# Altium schematic sheet Test_Jig_Project.SchDoc
size A3
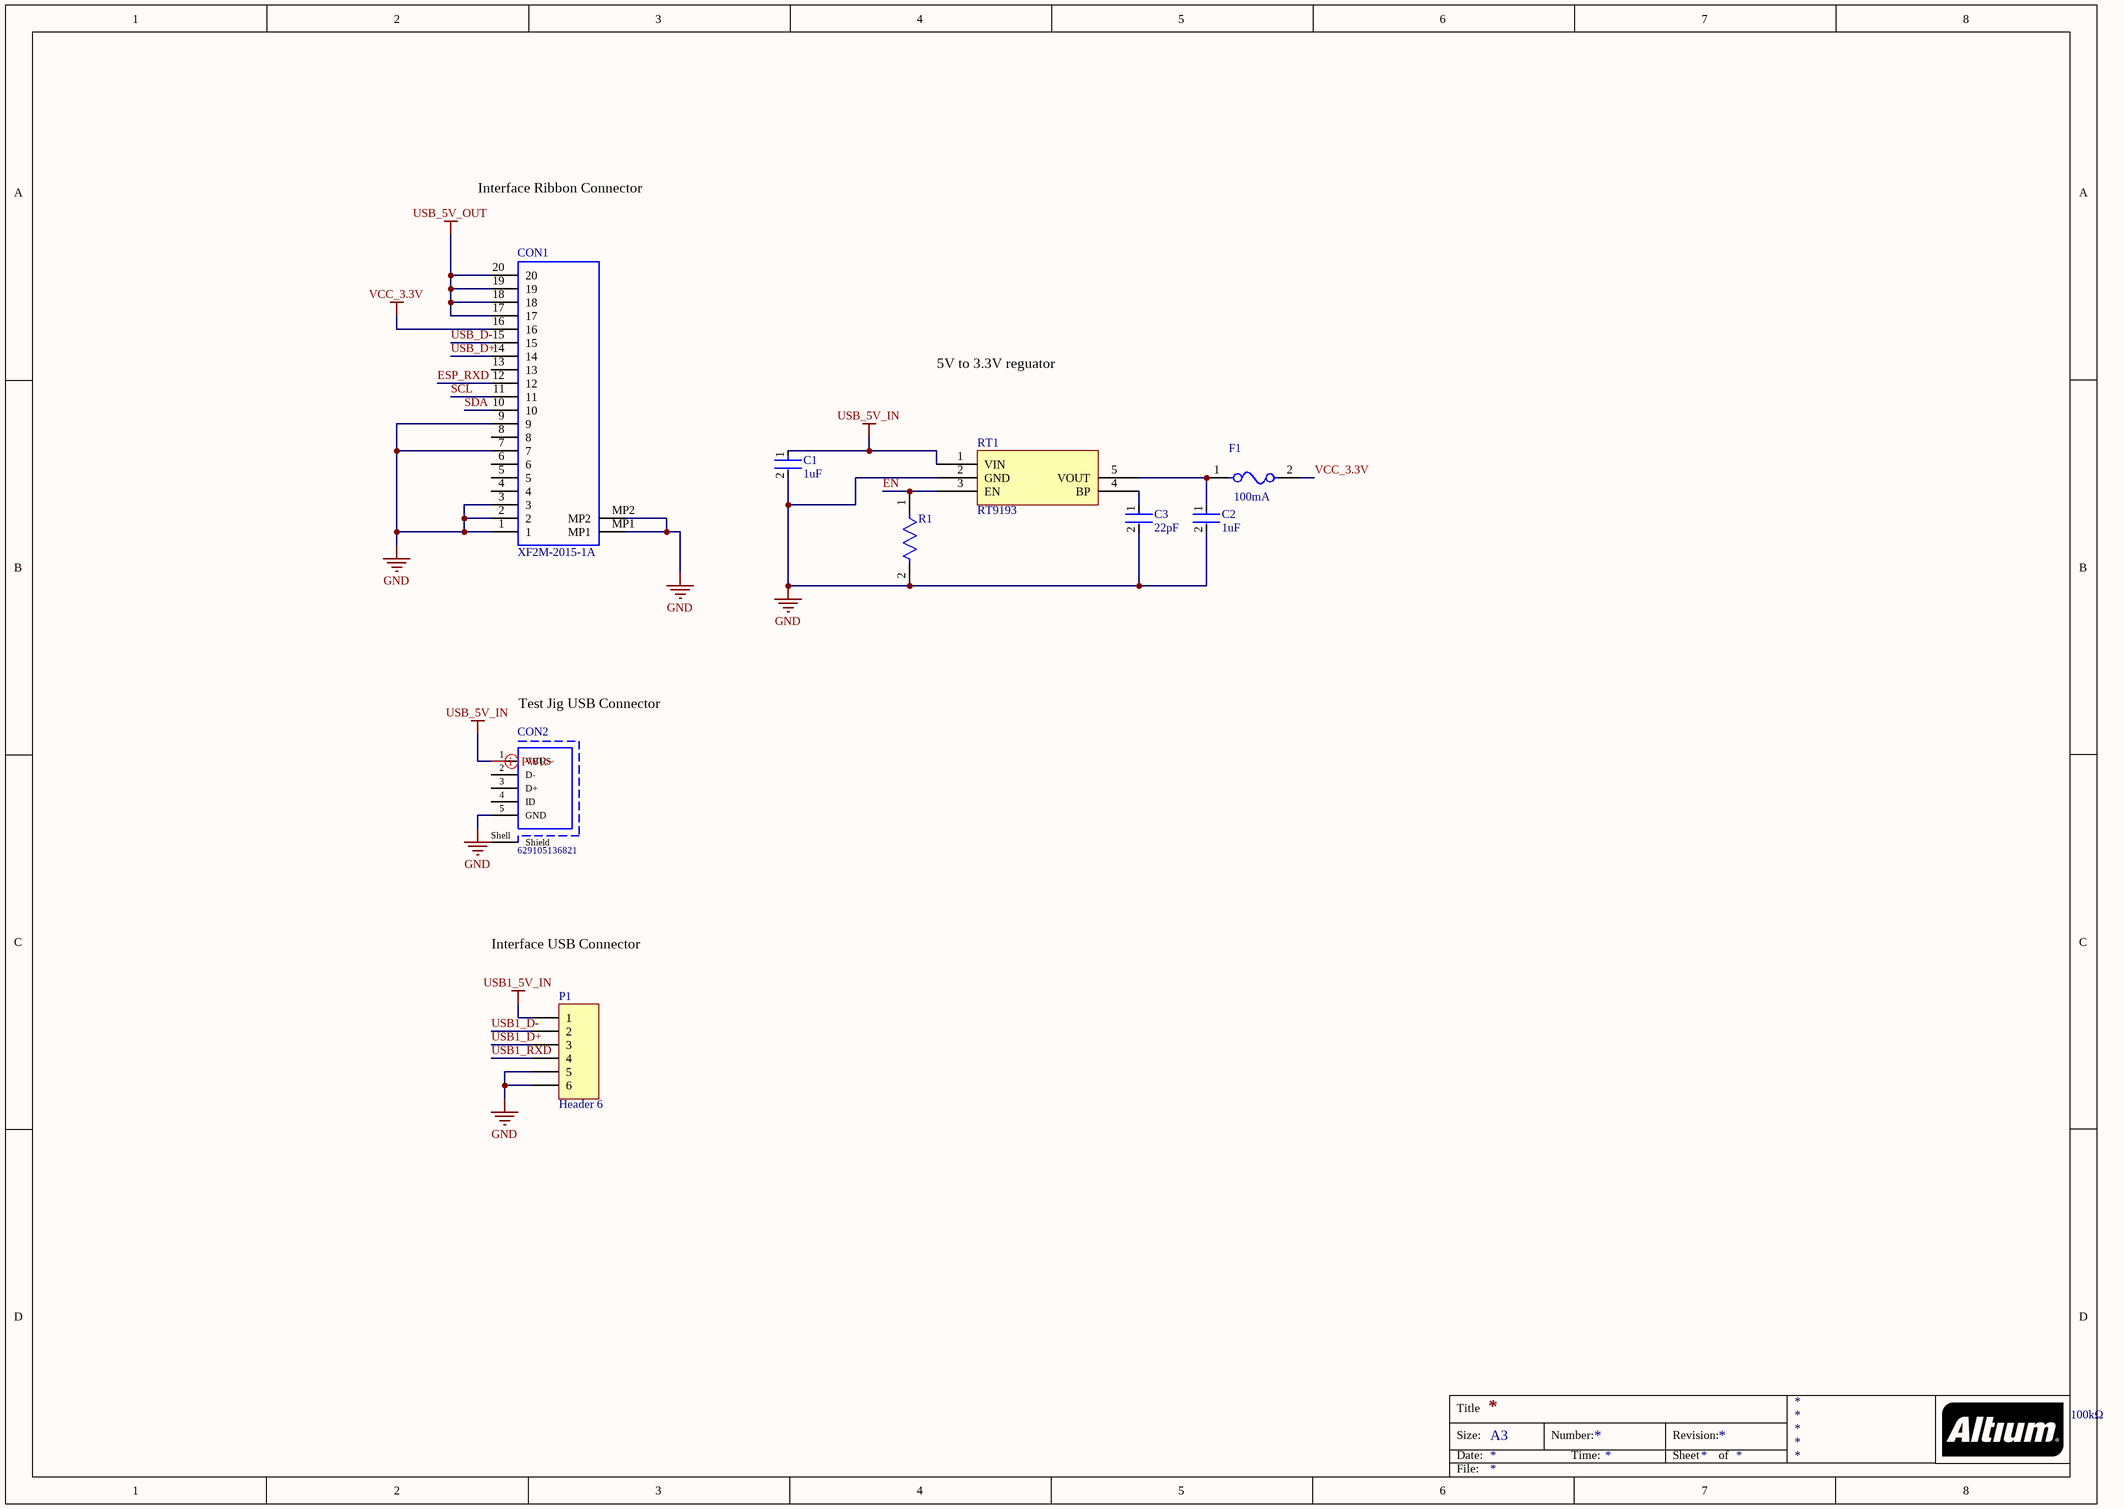
[diagram p0: Test_Jig_Project.SchDoc]

## Parts
C1  1uF  [FP-CC0805-0_85-MFG]
C2  1uF  [FP-CC0805-0_85-MFG]
C3  22pF  [FP-C0402-BB-MFG]
CON1  XF2M-2015-1A  [XF2M20151A]
CON2  629105136821  [629105136821]
F1  100mA  [FP-MF-PSMF-MFG]
P1  Header 6  [HDR1X6]
R1  100kΩ  [FP-CRCW0402-e3-IPC_C]
RT1  RT9193  [SOT85P279X130-5N]

## Nets
GND: C1.2 C2.2 C3.2 CON1.1 CON1.2 CON1.3 CON1.7 CON1.9 CON1.MP1 CON1.MP2 CON2.5(GND) P1.5 P1.6 R1.2 RT1.2(GND)
USB1_5V_IN: P1.1
USB_5V_IN: C1.1 CON2.1(VBUS) RT1.1(VIN)
USB_5V_OUT: CON1.17 CON1.18 CON1.19 CON1.20
VCC_3.3V: CON1.16 F1.2
EN: R1.1 RT1.3(EN)
ESP_RXD: CON1.12
SCL: CON1.11
SDA: CON1.10
USB1_D+: P1.3
USB1_D-: P1.2
USB1_RXD: P1.4
USB_D+: CON1.14
USB_D-: CON1.15
NetC2_1: C2.1 F1.1 RT1.5(VOUT)
NetC3_1: C3.1 RT1.4(BP)

Not connected (* = marked no-connect by the designer): CON1 4 5 6 8 13; CON2 2(D-) 3(D+) 4(ID) Shell(Shield)

## Layout directives
rule Width Constraint [Pref Width = 12mil    Min Width = 6mil    Max Width = 12mil]: USB_5V_IN

## Notes on the sheet
- Interface Ribbon Connector
- 5V to 3.3V reguator
- (near CON2) Test Jig USB Connector
- Interface USB Connector
- Manufacturer
- Title
- Size:
- Date:
- A3
- Number:
- Time:
- Revision:
- Sheet
- of
- File:

## Library data of the parts
C1 C2 = CMP-03422-000182-1: CAP CER 1UF 10V X7R 0805; Manufacturer: Yageo; Mfr. Part #: CC0805KKX7R6BB105; Material: Ceramic; Tolerance: 0.1; Value: 1 uF; ComponentLink2URL: http://www.yageo.com/documents/recent/UPY-GPHC_Y5V_6.3V-to-50V_8.pdf; Automotive: No; Temperature Range Low: -30°C; Octopart: https://octopart.com/cc0805kkx7r6bb105-yageo-42522859; Temperature Characteristic: X7R; RoHS: TRUE; Voltage Rating: 10 V; Capacitance: 1 uF; Package: CC0805-0.85; Device Class L3: Ceramic Capacitors; Category: Cap; Mouser Description: Multilayer Ceramic Capacitors MLCC - SMD/SMT 1.0uF 10V X7R 10%; Temperature Range High: +85°C; Ipc Land Pattern Name: CAPC200125X85; ComponentLink2Description: Datasheet; Temperature: -30°C to +85°C; Height: 0.95mm; Lead Free: Yes; Device Class L1: Passive Components; Device Class L2: Capacitors; Footprint Url: http://www.yageo.com/exep/pages/download/literatures/UPY-C_GEN_24.pdf; Digikey Description: CAP CER 1UF 10V X7R 0805
C3 = CMP-1034-00897-3: CAP CER 22PF 10V NP0 0402; Mfr. Part #: C0402C220K8GACTU; Manufacturer: Kemet; Temperature Coefficient: 15%; Tolerance: 0.1; Temperature Characteristic: C0G; Material: Ceramic; Ipc Land Pattern Name: CAPC10050X50; Mouser Description: Multilayer Ceramic Capacitors MLCC - SMD/SMT 10volts 22pF C0G 10%; Temperature Range High: +125°C; Voltage Rating: 10 V; ComponentLink2Description: Datasheet; Digikey Description: CAP CER 22PF 10V NP0 0402; Device Class L1: Passive Components; Category: Cap; Temperature: -55°C to +125°C; Temperature Range Low: -55°C; ComponentLink2URL: https://content.kemet.com/datasheets/KEM_C1002_X7R_SMD.pdf; Automotive: No; Package: C0402-BB; RoHS: TRUE; Device Class L3: Ceramic Capacitors; Value: 22 pF; Height: 0.55mm; Octopart: https://octopart.com/c0402c220k8gactu-kemet-12592189; Capacitance: 22 pF; Lead Free: Yes; Device Class L2: Capacitors
CON1 = XF2M-2015-1A: OMRON - XF2M-2015-1A - FFC / FPC Board Connector, 0.5 mm, 20 Contacts, Receptacle, XF Series, Surface Mount, Top, Bottom; Manufacturer: Omron Electronics; Geometry.Height: 3.2mm; Mfr. Part #: XF2M-2015-1A; Mouser Part Number: 653-XF2M-2015-1A; Mouser Price/Stock: https://www.mouser.co.uk/ProductDetail/Omron-Electronics/XF2M-2015-1A?qs=9iNEzSI19qWZ677VhkompQ%3D%3D; Arrow Part Number: *; Unit Price: US$ 0.4815; Datasheet Link: https://datasheet.lcsc.com/lcsc/1912111437_Omron-Electronics-XF2M-2015-1A_C57541.pdf
CON2 = CMP-1502-03253-1: Micro USB 2.0 Type B Receptacle WR-COM, Horizontal, SMT, with Pads and Pegs; Manufacturer: Wurth Elektronik; Mfr. Part #: 629105150521; Contact Resistance: 30mOhm; Rated Current: 1A; Working Voltage: 30VAC; Datasheet URL: https://katalog.we-online.de/em/datasheet/629105136821.pdf; Mounting Technology: SMT; Publisher: WurthElektronik; Package Reference: 629105136821; Orientation: Horizontal; Packaging: TapeandReel; Manufacturer URL: http://www.we-online.de; Connector Type: MicroUSB2.0TypeB; Gender: Receptacle; Operating Temperature: -40to105degC
F1 = CMP-07400-000017-1: PTC RESET FUSE 15V 100MA 0805; Mfr. Part #: MF-PSMF010X-2; Manufacturer: Bourns Inc.; Resistance: 1-7.5Ω; Value: 1-7.5Ω; Current Rating: 40A; Hold Current: 0.1A; Trip Current: 0.3A; Trip Time: 1.5s; Temperature: -40°C to +85°C; ComponentLink2Description: Datasheet; Lead Free: Yes; Ipc Land Pattern Name: CAPC215135X67; Device Class L1: Circuit Protection; Mouser Description: Resettable Fuses - PPTC 0.10A 15V 1ohm; Automotive: No; Octopart: https://octopart.com/mf-psmf010x-2-bourns-7483441; RoHS: TRUE; Temperature Range High: +85°C; Digikey Description: PTC RESET FUSE 15V 100MA 0805; Device Class L3: unset; ComponentLink2URL: https://www.bourns.com/docs/Product-Datasheets/mfpsmf.pdf; Height: 0.85mm; Voltage Rating: 15V; Ambient Temperature Range Low: -40°C; Category: Fuse; Package: MF-PSMF; Temperature Range Low: -40°C; Device Class L2: PTC Resettable Fuses; Ambient Temperature Range High: +85°C
P1 = Header 6: Header, 6-Pin; LatestRevisionDate: 17-Jul-2002; LatestRevisionNote: Re-released for DXP Platform.; Publisher: Altium Limited
R1 = CMP-2002-08123-3: RES Thick Film, 100kΩ, 1%, 0.063W, 100ppm/°C, 0402; Manufacturer: Stackpole Electronics; Mfr. Part #: RMCF0402FT100K; Power Rating: 63mW; Resistance: 100kR; Voltage Rating (DC): 50V; Lead Free: Lead Free; Height: 0.35mm; Contact Plating: Tin; Min Operating Temperature: -55°C; Package Quantity: 10000; Case/Package: 0402; Temperature Coefficient: 100ppm/°C; Number of Terminations: 2; Packaging: Tape and Reel; Max Power Dissipation: 63mW; Case Code (Metric): 1005; Mount: Surface Mount; Width: 0.02inch; Termination: SMD/SMT; Length: 1mm; Number of Pins: 2; Weight: 2.3E-05oz; Radiation Hardening: No; Tolerance: 1%; Military Standard: Not; Features: Automotive AEC-Q200; Depth: 0.5mm; Composition: Thick Film; Max Operating Temperature: 155°C; Voltage Rating: 50V; Case Code (Imperial): 0402
RT1 = Component_1: 300mA 70dB@(100Hz),50dB@(10kHz) 300mV@(300mA) Fixed 3.3V~3.3V Positive 1 5.5V SOT-23-5 Linear Voltage Regulators (LDO) ROHS; Manufacturer: Richtek Tech; Mfr. Part #: RT9193-33GB